# EAGLE design Antennaboard_AndesiteV3Rel (EAGLE 6.5.0)

## Sheet 1 of 2
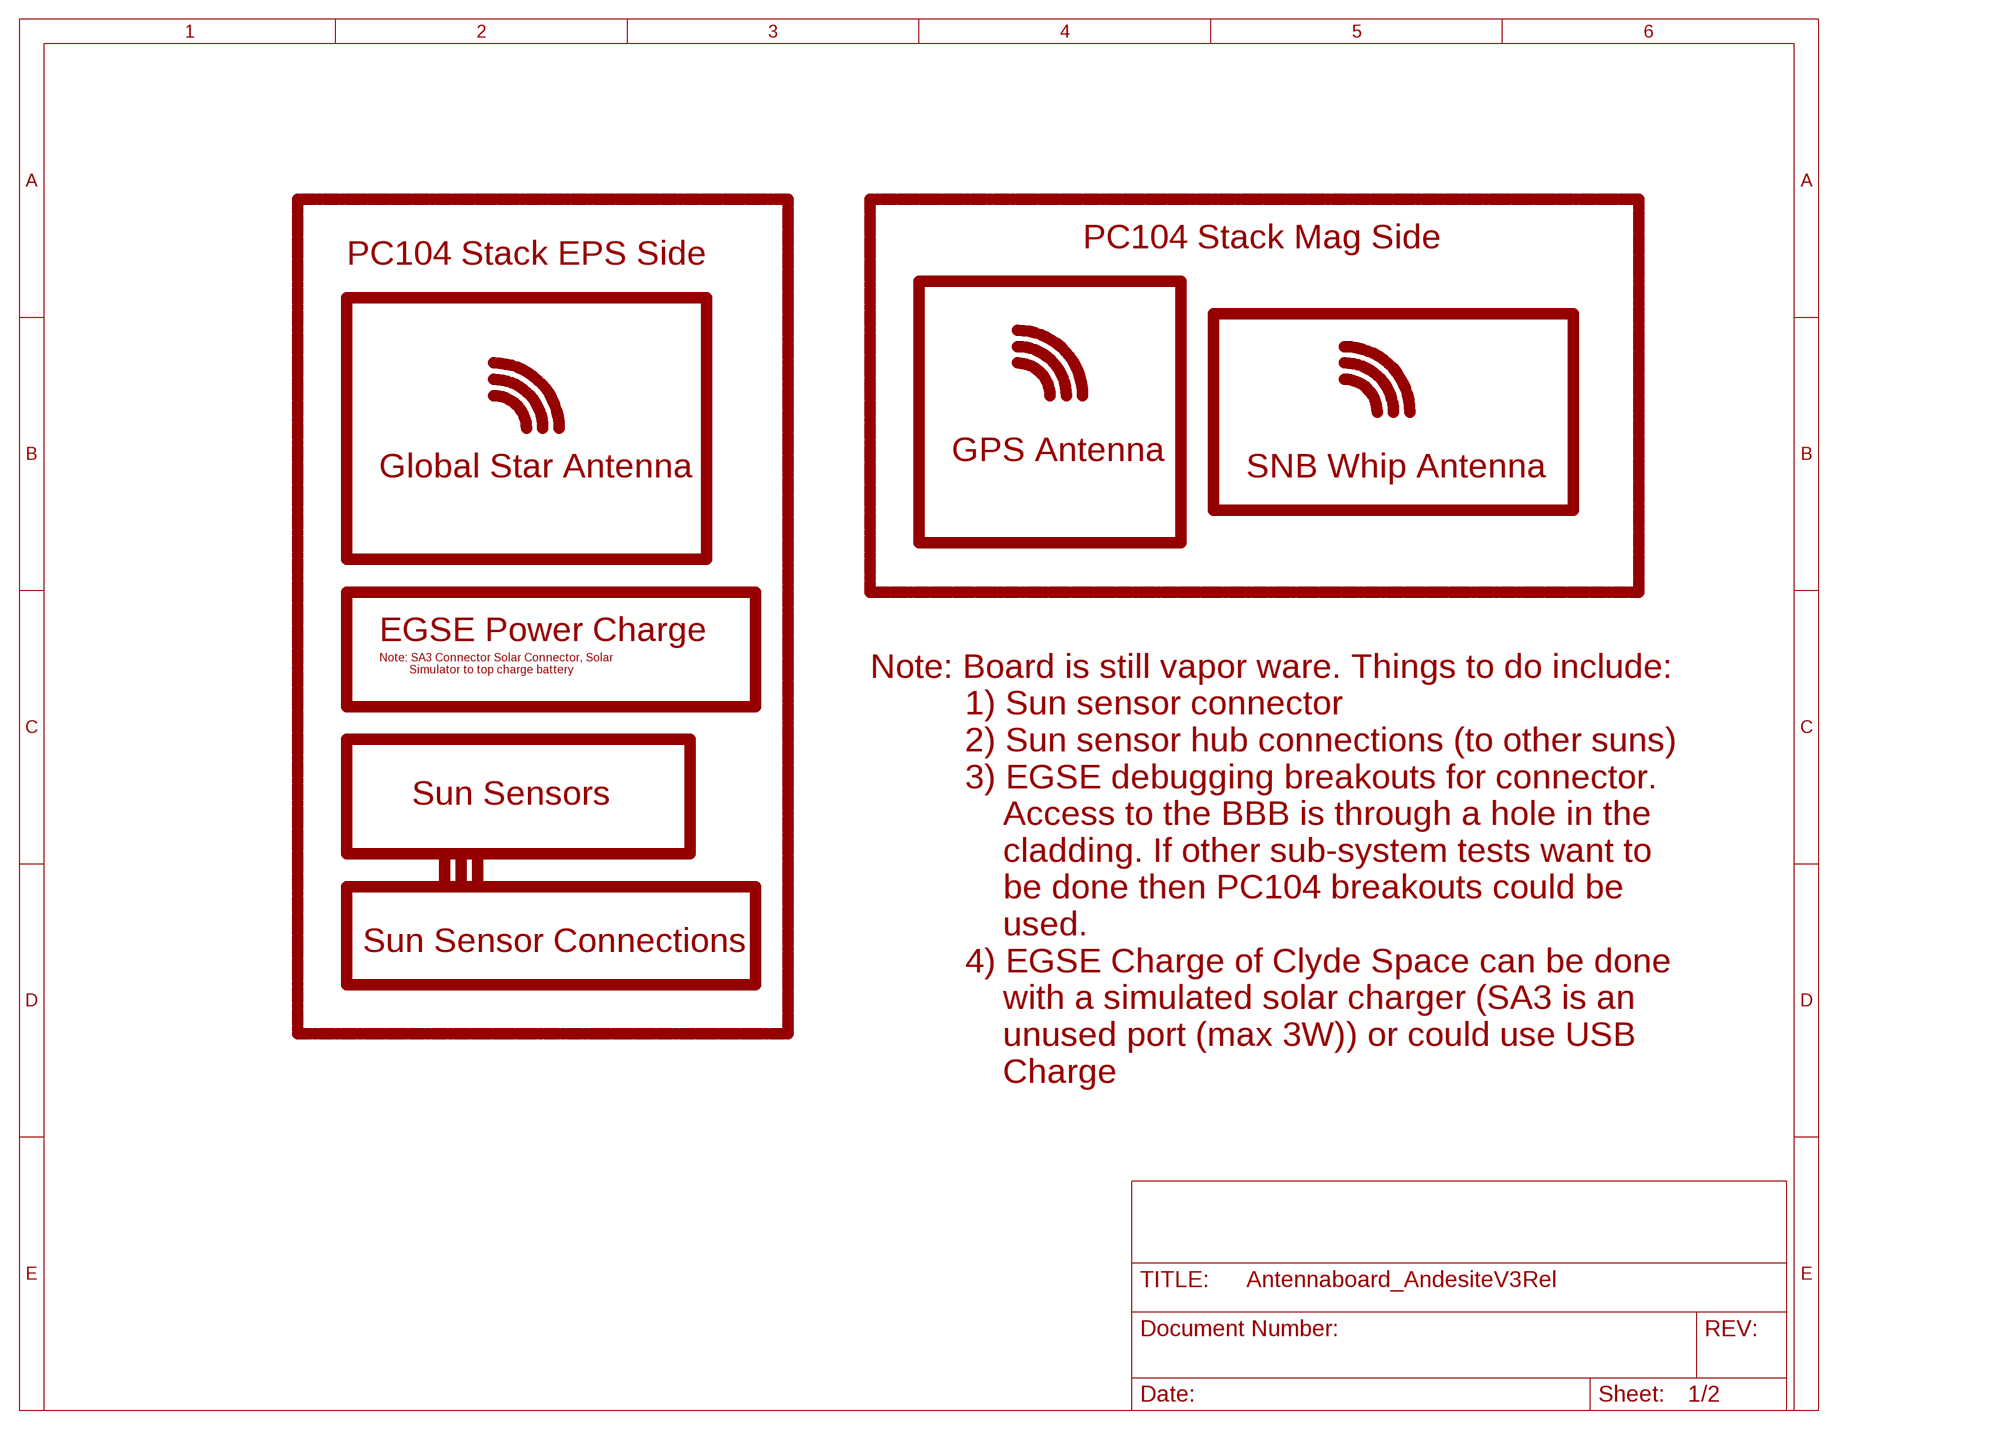
[diagram p0: schematic, sheet 1]

### Notes on the sheet
- PC104 Stack Mag Side
- PC104 Stack EPS Side
- GPS Antenna
- Global Star Antenna | SNB Whip Antenna
- EGSE Power Charge
- Note: SA3 Connector Solar Connector, Solar 
            Simulator to top charge battery
- Sun Sensors
- Sun Sensor Connections
- Note: Board is still vapor ware. Things to do include:
            1) Sun sensor connector
            2) Sun sensor hub connections (to other suns)
            3) EGSE debugging breakouts for connector. 
                Access to the BBB is through a hole in the 
                cladding. If other sub-system tests want to 
                be done then PC104 breakouts could be 
                used.
            4) EGSE Charge of Clyde Space can be done 
                with a simulated solar charger (SA3 is an 
                unused port (max 3W)) or could use USB 
                Charge

## Sheet 2 of 2
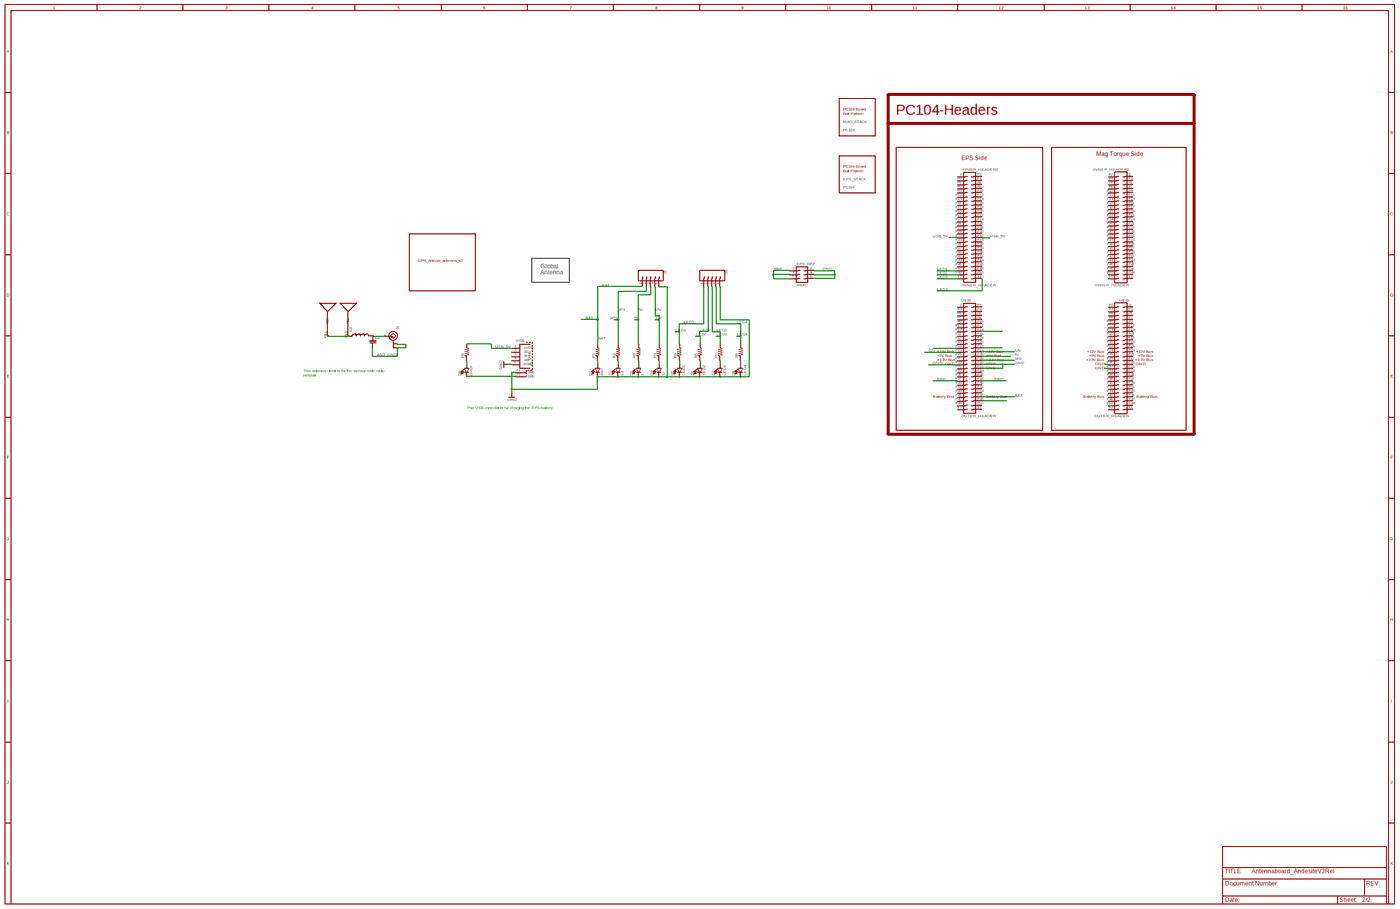
[diagram p1: schematic, sheet 2, overview]
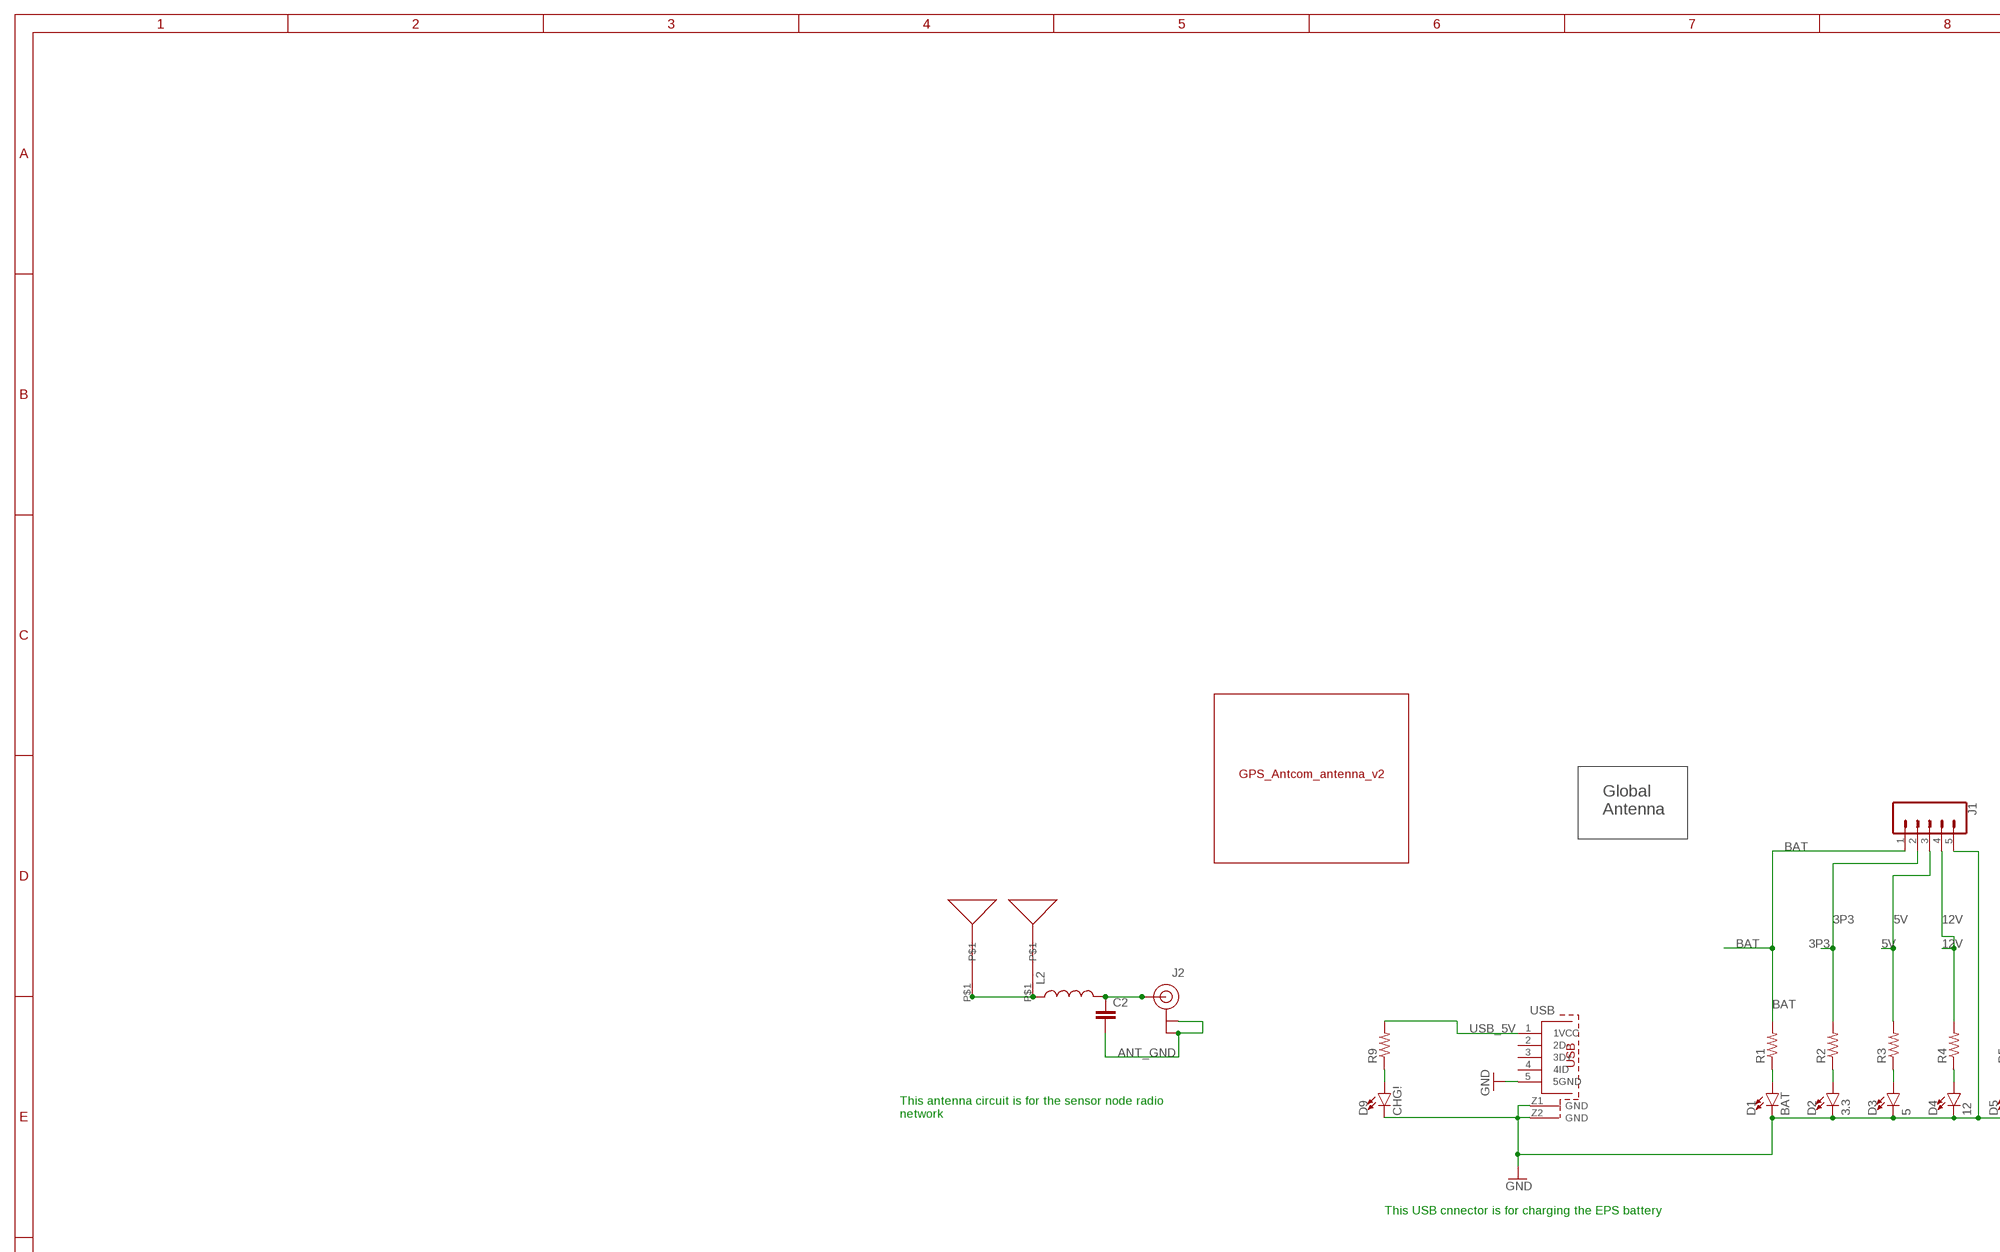
[diagram p2: schematic, sheet 2, part 1 of 4]
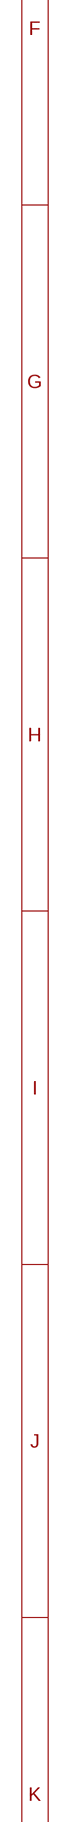
[diagram p3: schematic, sheet 2, part 2 of 4]
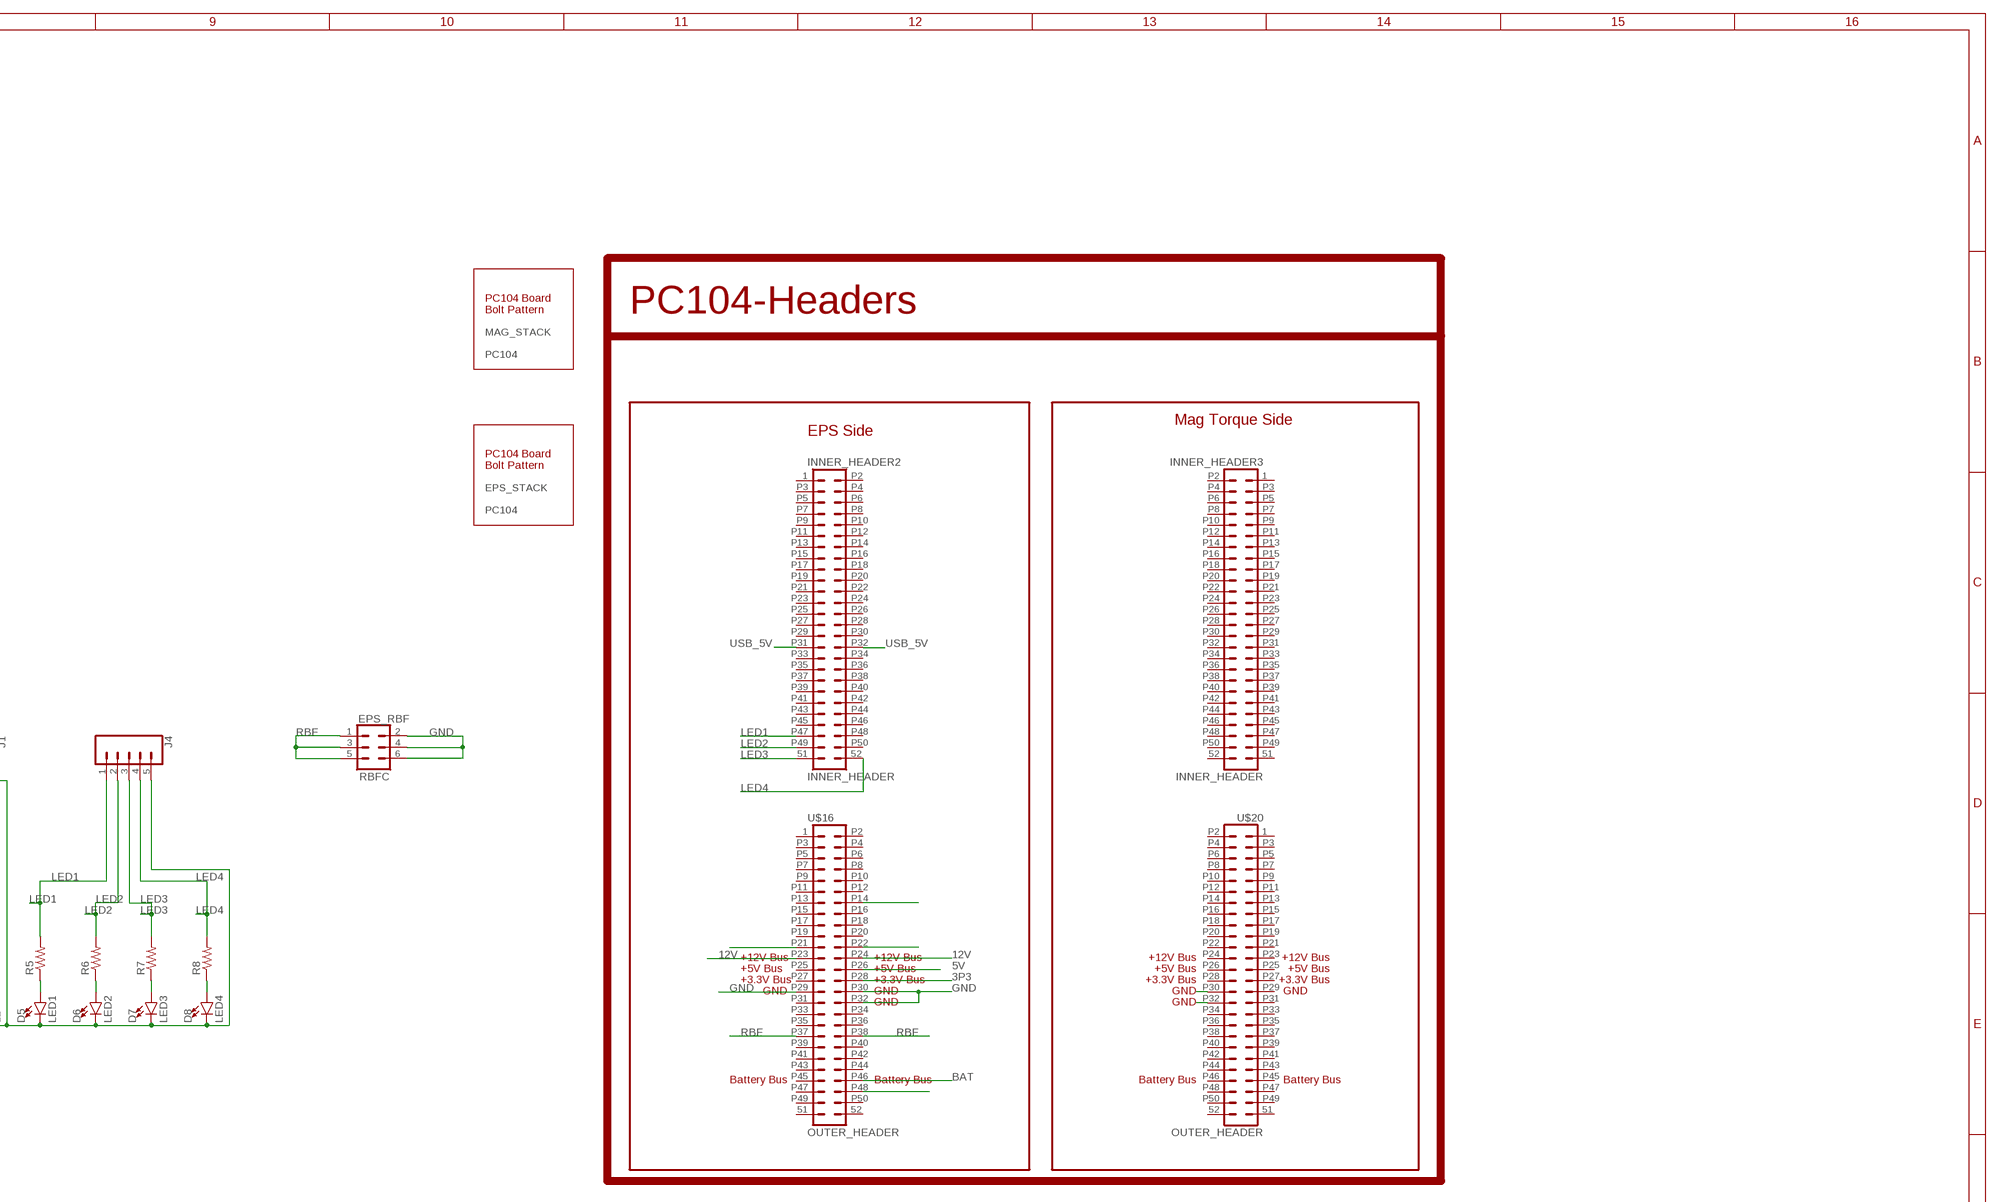
[diagram p4: schematic, sheet 2, part 3 of 4]
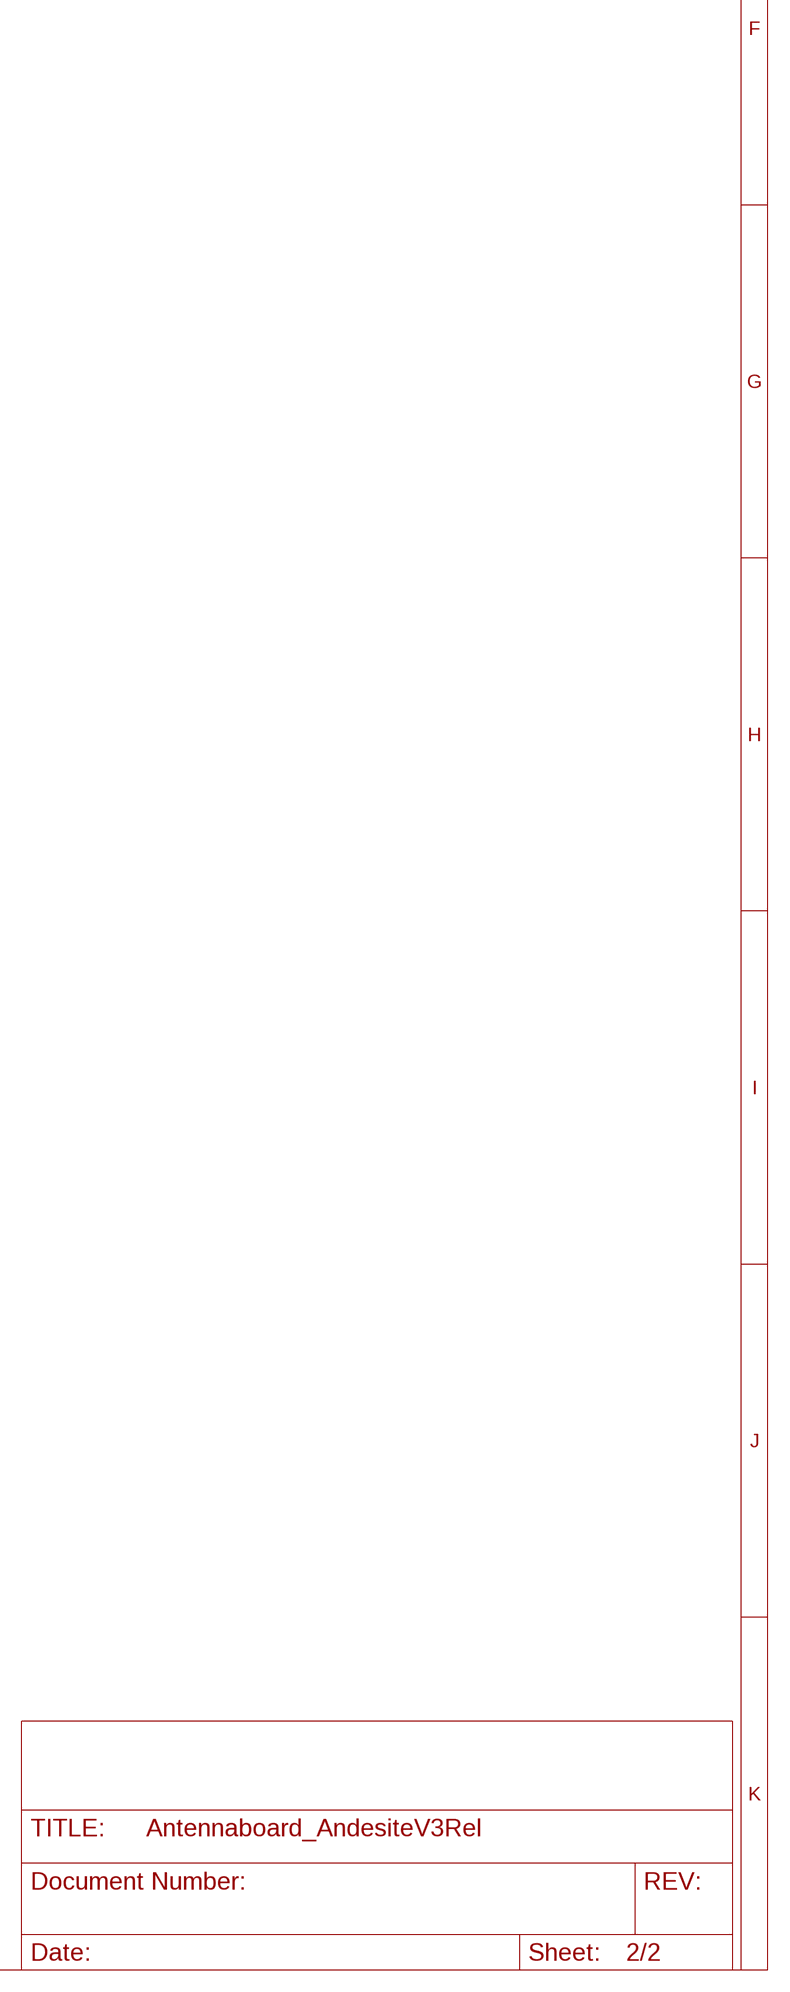
[diagram p5: schematic, sheet 2, part 4 of 4]

### Parts
C2  CAP1210  [1210]
D1  BAT  LED-RED0603  [LED-0603]
D2  3.3  LED-RED0603  [LED-0603]
D3  5  LED-RED0603  [LED-0603]
D4  12  LED-RED0603  [LED-0603]
D5  LED1  LED-RED0603  [LED-0603]
D6  LED2  LED-RED0603  [LED-0603]
D7  LED3  LED-RED0603  [LED-0603]
D8  LED4  LED-RED0603  [LED-0603]
D9  CHG!  LED-RED0603  [LED-0603]
EPS_RBF  RBFC  CONN_03X2FEMALE  [2X3]
EPS_STACK  PC104  [PC104]
INNER_HEADER2  INNER_HEADER  [2X26]
INNER_HEADER3  INNER_HEADER  [2X26]
J1  CONN_05NO_SILK  [1X05_NO_SILK]
J2  U.FL  [U.FL]
J4  CONN_05NO_SILK  [1X05_NO_SILK]
L2  INDUCTOR1210  [1210]
MAG_STACK  PC104  [PC104]
R1  R-US_R0603  [R0603]
R2  R-US_R0603  [R0603]
R3  R-US_R0603  [R0603]
R4  R-US_R0603  [R0603]
R5  R-US_R0603  [R0603]
R6  R-US_R0603  [R0603]
R7  R-US_R0603  [R0603]
R8  R-US_R0603  [R0603]
R9  R-US_R0603  [R0603]
U$1  ANTENNA  [GLOBAL_ANTENNA]
U$2  GPS_ANTCOM_ANTENNA  [GPS_ANTCOM_2]
U$3  SNB_ANT  [SLOT]
U$16  OUTER_HEADER  [2X26]
U$18  SNB_ANT  [SLOT]
U$20  OUTER_HEADER  [2X26]
USB  614105150721  [614105150721]

### Nets
3P3: J1.2 R2.2 U$16.P28
5V: J1.3 R3.2 U$16.P26
12V: J1.4 R4.2 U$16.P23 U$16.P24
ANT_GND: C2.2 J2.P$1(GND) J2.P$2(GND)
BAT: J1.1 R1.2 U$16.P46
GND: D1.C D2.C D3.C D4.C D5.C D6.C D7.C D8.C D9.C EPS_RBF.2 EPS_RBF.4 EPS_RBF.6 J1.5 J4.5 U$16.P21 U$16.P22 U$16.P29 U$16.P30 U$16.P32 U$16.P48 USB.5(5GND) USB.Z1(GND) USB.Z2(GND)
LED1: INNER_HEADER2.P47 J4.1 R5.2
LED2: INNER_HEADER2.P49 J4.2 R6.2
LED3: INNER_HEADER2.51 J4.3 R7.2
LED4: INNER_HEADER2.52 J4.4 R8.2
N$2: D9.A R9.1
N$3: U$20.P32
N$4: U$20.P30
N$7: D1.A R1.1
N$8: U$16.P14
N$20: D2.A R2.1
N$21: D3.A R3.1
N$22: D4.A R4.1
N$23: D5.A R5.1
N$24: D6.A R6.1
N$25: D7.A R7.1
N$26: D8.A R8.1
N$37: C2.1 J2.P$3(SIGNAL) L2.2
N$38: L2.1 U$3.P$1 U$18.P$1
RBF: EPS_RBF.1 EPS_RBF.3 EPS_RBF.5 U$16.P37 U$16.P38
USB_5V: INNER_HEADER2.P31 INNER_HEADER2.P32 R9.2 USB.1(1VCC)
Unconnected: INNER_HEADER2.1 INNER_HEADER2.P2 INNER_HEADER2.P3 INNER_HEADER2.P4 INNER_HEADER2.P5 INNER_HEADER2.P6 INNER_HEADER2.P7 INNER_HEADER2.P8 INNER_HEADER2.P9 INNER_HEADER2.P10 INNER_HEADER2.P11 INNER_HEADER2.P12 INNER_HEADER2.P13 INNER_HEADER2.P14 INNER_HEADER2.P15 INNER_HEADER2.P16 INNER_HEADER2.P17 INNER_HEADER2.P18 INNER_HEADER2.P19 INNER_HEADER2.P20 INNER_HEADER2.P21 INNER_HEADER2.P22 INNER_HEADER2.P23 INNER_HEADER2.P24 INNER_HEADER2.P25 INNER_HEADER2.P26 INNER_HEADER2.P27 INNER_HEADER2.P28 INNER_HEADER2.P29 INNER_HEADER2.P30 INNER_HEADER2.P33 INNER_HEADER2.P34 INNER_HEADER2.P35 INNER_HEADER2.P36 INNER_HEADER2.P37 INNER_HEADER2.P38 INNER_HEADER2.P39 INNER_HEADER2.P40 INNER_HEADER2.P41 INNER_HEADER2.P42 INNER_HEADER2.P43 INNER_HEADER2.P44 INNER_HEADER2.P45 INNER_HEADER2.P46 INNER_HEADER2.P48 INNER_HEADER2.P50 INNER_HEADER3.1 INNER_HEADER3.51 INNER_HEADER3.52 INNER_HEADER3.P2 INNER_HEADER3.P3 INNER_HEADER3.P4 INNER_HEADER3.P5 INNER_HEADER3.P6 INNER_HEADER3.P7 INNER_HEADER3.P8 INNER_HEADER3.P9 INNER_HEADER3.P10 INNER_HEADER3.P11 INNER_HEADER3.P12 INNER_HEADER3.P13 INNER_HEADER3.P14 INNER_HEADER3.P15 INNER_HEADER3.P16 INNER_HEADER3.P17 INNER_HEADER3.P18 INNER_HEADER3.P19 INNER_HEADER3.P20 INNER_HEADER3.P21 INNER_HEADER3.P22 INNER_HEADER3.P23 INNER_HEADER3.P24 INNER_HEADER3.P25 INNER_HEADER3.P26 INNER_HEADER3.P27 INNER_HEADER3.P28 INNER_HEADER3.P29 INNER_HEADER3.P30 INNER_HEADER3.P31 INNER_HEADER3.P32 INNER_HEADER3.P33 INNER_HEADER3.P34 INNER_HEADER3.P35 INNER_HEADER3.P36 INNER_HEADER3.P37 INNER_HEADER3.P38 INNER_HEADER3.P39 INNER_HEADER3.P40 INNER_HEADER3.P41 INNER_HEADER3.P42 INNER_HEADER3.P43 INNER_HEADER3.P44 INNER_HEADER3.P45 INNER_HEADER3.P46 INNER_HEADER3.P47 INNER_HEADER3.P48 INNER_HEADER3.P49 INNER_HEADER3.P50 U$16.1 U$16.51 U$16.52 U$16.P2 U$16.P3 U$16.P4 U$16.P5 U$16.P6 U$16.P7 U$16.P8 U$16.P9 U$16.P10 U$16.P11 U$16.P12 U$16.P13 U$16.P15 U$16.P16 U$16.P17 U$16.P18 U$16.P19 U$16.P20 U$16.P25 U$16.P27 U$16.P31 U$16.P33 U$16.P34 U$16.P35 U$16.P36 U$16.P39 U$16.P40 U$16.P41 U$16.P42 U$16.P43 U$16.P44 U$16.P45 U$16.P47 U$16.P49 U$16.P50 U$20.1 U$20.51 U$20.52 U$20.P2 U$20.P3 U$20.P4 U$20.P5 U$20.P6 U$20.P7 U$20.P8 U$20.P9 U$20.P10 U$20.P11 U$20.P12 U$20.P13 U$20.P14 U$20.P15 U$20.P16 U$20.P17 U$20.P18 U$20.P19 U$20.P20 U$20.P21 U$20.P22 U$20.P23 U$20.P24 U$20.P25 U$20.P26 U$20.P27 U$20.P28 U$20.P29 U$20.P31 U$20.P33 U$20.P34 U$20.P35 U$20.P36 U$20.P37 U$20.P38 U$20.P39 U$20.P40 U$20.P41 U$20.P42 U$20.P43 U$20.P44 U$20.P45 U$20.P46 U$20.P47 U$20.P48 U$20.P49 U$20.P50 USB.2(2D-) USB.3(3D+) USB.4(4ID)

### Notes on the sheet
- PC104-Headers
- Mag Torque Side
- EPS Side
- This antenna circuit is for the sensor node radio
  network
- This USB cnnector is for charging the EPS battery

## Library data of the parts
C2 = SparkFun-Passives:CAP: Capacitor Standard 0603 ceramic capacitor, and 0.1" leaded capacitor.
D1-D9 = SparkFun-LED:LED-RED: Red SMD LED Used in manufacturing of most products at SparkFun Packages: 0603 - SMD 0603 package [Product Link] <http://docs.avagotech.com/docs/AV02-0551EN> 0603 SMART - SMD 0603 SMART package ( more efficient and expensive)[Product Link] <http://www.osram-os.com/Graphics/XPic2/00077099_0.pdf> 1206 - SMD1206 package [Product Link] <https://www.sparkfun.com/datasheets/DevTools/LilyPad/Q150OVS4.pdff> SparkFun Products: Pro Mini 328 -5V <https://www.sparkfun.com/products/821> RedBoard <https://www.sparkfun.com/products/12757> IOIO-OTG <https://www.sparkfun.com/products/13613>; PROD_ID: DIO-00819; VALUE: RED
EPS_RBF = SparkFun-Connectors:CONN_03X2: Multi connection point. Often used as Generic Header-pin footprint for 0.1 inch spaced/style header connections You can populate with any combo of single row headers, but if you'd like an exact match, check these: Header - 2x3 (Male, 0.1") <https://www.sparkfun.com/products/12807> (PRT-12807) Header - 2x3 (Female, 0.1") <https://www.sparkfun.com/products/13010> (PRT-13010) 2x3 Pin Shrouded Header <https://www.sparkfun.com/products/10877> (PRT-10877) On any of the 0.1 inch spaced packages, you can populate with these: Break Away Headers - Straight <https://www.sparkfun.com/products/116> (PRT-00116) Break Away Male Headers - Right Angle <https://www.sparkfun.com/products/553> (PRT-00553) Female Headers <https://www.sparkfun.com/products/115> (PRT-00115) Break Away Headers - Machine Pin <https://www.sparkfun.com/products/117> (PRT-00117) Break Away Female Headers - Swiss Machine Pin <https://www.sparkfun.com/products/743> (PRT-00743) Special note: the shrouded connector mates well with our 3x2 ribbon cables: Ribbon Crimp Connector - 6-pin (2x3, Female) <https://www.sparkfun.com/products/10651> (PRT-10651) Ribbon Cable - 6 wire (15ft) <https://www.sparkfun.com/products/10646> (PRT-10646); PROD_ID: CONN-11566; VALUE: FEMALE 2x3
EPS_STACK MAG_STACK = PC104_Cubesat:PC104
INNER_HEADER2 INNER_HEADER3 = PC104_Cubesat:INNER_HEADER
J1 J4 = SparkFun-Connectors:CONN_05: Multi connection point. Often used as Generic Header-pin footprint for 0.1 inch spaced/style header connections On any of the 0.1 inch spaced packages, you can populate with these: Break Away Headers - Straight <https://www.sparkfun.com/products/116> (PRT-00116) Break Away Male Headers - Right Angle <https://www.sparkfun.com/products/553> (PRT-00553) Female Headers <https://www.sparkfun.com/products/115> (PRT-00115) Break Away Headers - Machine Pin <https://www.sparkfun.com/products/117> (PRT-00117) Break Away Female Headers - Swiss Machine Pin <https://www.sparkfun.com/products/743> (PRT-00743) For SCREWTERMINALS and SPRING TERMINALS visit here: Screw Terimnals on SparkFun.com <https://www.sparkfun.com/search/results?term=Screw+Terminals> (5mm/3.5mm/2.54mm spacing) This device is also useful as a general connection point to wire up your design to another part of your project. Our various solder wires solder well into these plated through hole pads. Hook-Up Wire - Assortment (Stranded, 22 AWG) <https://www.sparkfun.com/products/11375> (PRT-11375) Hook-Up Wire - Assortment (Solid Core, 22 AWG) <https://www.sparkfun.com/products/11367> (PRT-11367) View the entire wire category on our website here <https://www.sparkfun.com/categories/141> Special notes: Molex polarized connector foot print use with SKU : PRT-08231 with associated crimp pins and housings. 1MM SMD Version SKU: PRT-10208
J2 = SparkFun-Connectors:U.FL: SMD antenna connector- WRL-09144; PROD_ID: CONN-09193
L2 = SparkFun-Passives:INDUCTOR: Inductors Basic Inductor/Choke - 0603 and 1206. Footprints are not proven and vary greatly between part numbers. INDUCTOR POWER 3.3UH 4.0A SMD 0.197" L x 0.197" W x 0.177" H (5.00mm x 5.00mm x 4.50mm)
R1-R9 = resistor:R-US_: RESISTOR, American symbol
U$1 = PC104_Cubesat:ANTENNA
U$2 = GPS_antcom_05022017v1:GPS_ANTCOM_ANTENNA
U$3 U$18 = PC104_Cubesat:SNB_ANT
U$16 U$20 = PC104_Cubesat:OUTER_HEADER
USB = Wurth_Elektronik_Electromechanic_Input-Output_Connectors_rev16b:614105150721: WR-COM_USB_Micro Type B_Vertical_THT; Micro Type B Vertical THT- Tape & Reel not for Pick & Place machine Code : Con_I-O_COM_USB_2.0_B_614105150721_614105150721 <http://katalog.we-online.de/media/images/eican/Con_I-O_COM_USB_2.0_B_614105150721_pf2.jpg> Details see: http://katalog.we-online.de/em/datasheet/614105150721.pdf Created 12/08/2014, Dan Xu 2014 (C) Wurth Elektronik

## Board
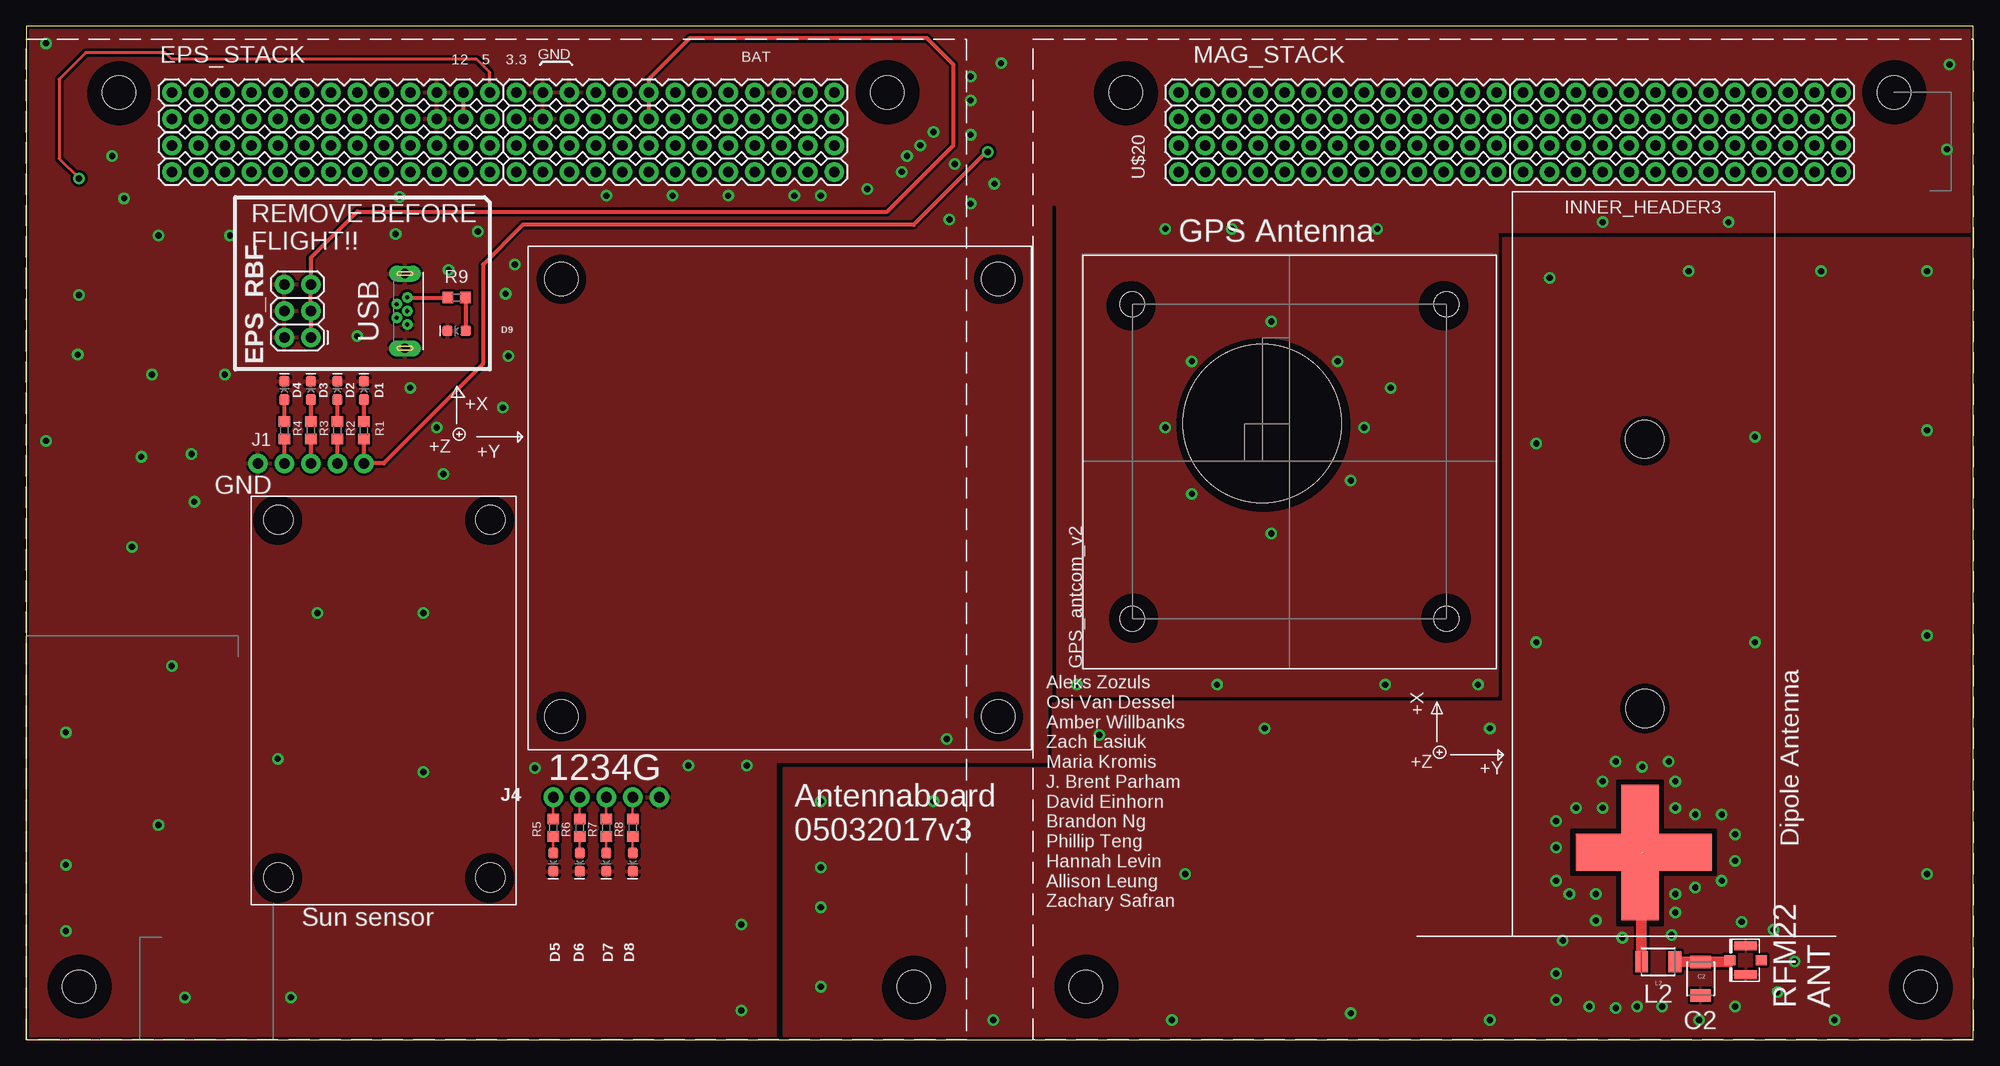
[diagram p6: board, top side]
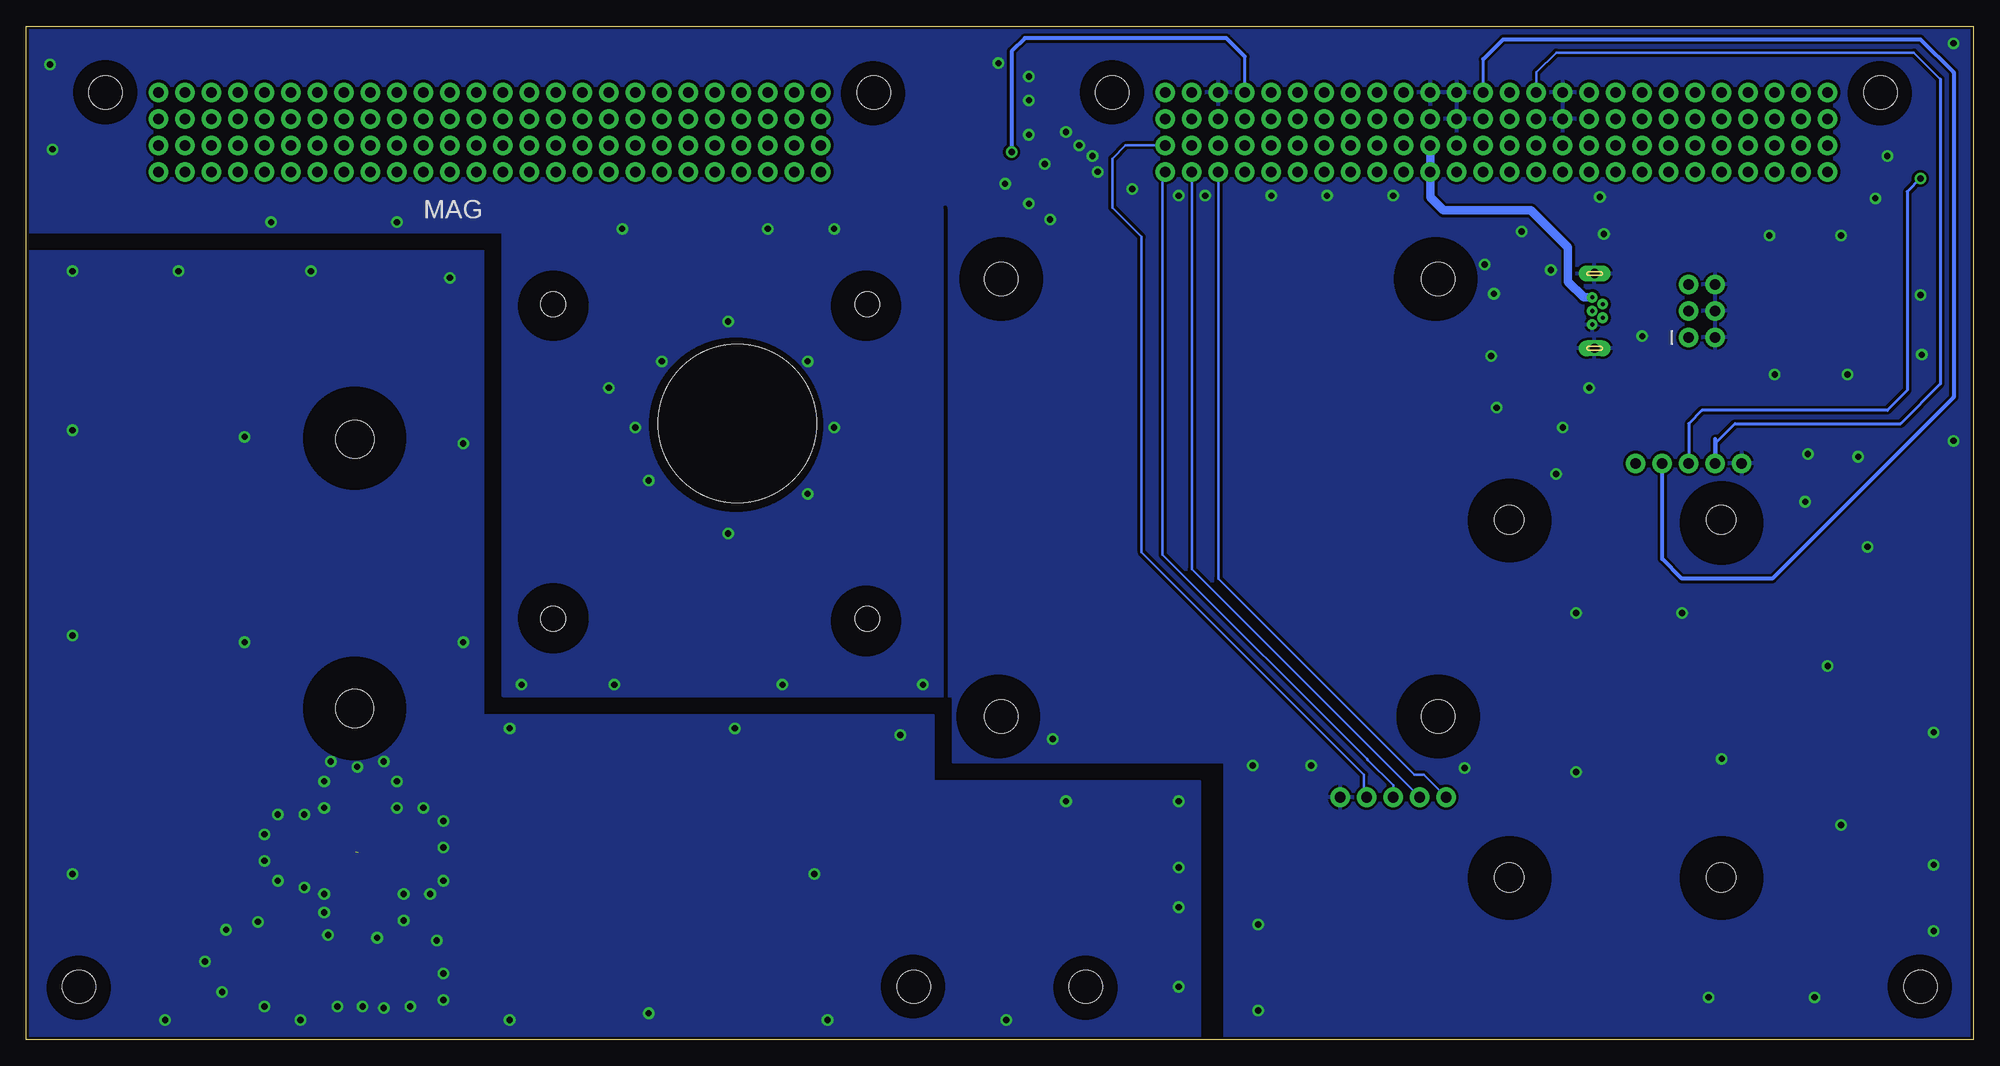
[diagram p7: board, bottom side, seen from below]

Size 186.69 x 97.16 mm. Coordinates in mm from the lower left corner, seen from the top.
Outline: 0,0 186.69,0 186.69,97.16 0,97.16 0,0
Copper layers (1*16): Top 0.035mm / dielectric 1.5mm / Bottom 0.035mm
Design rules "SparkFun *": minimum track width 8mil, minimum drill 15mil, track to track 10mil, track to pad 8mil, pad to pad 6mil, via to via 8mil, smd to smd 6mil, copper to edge 10mil, drill to drill 8mil, minimum pad ring 12mil, minimum via ring 10mil, stop-mask expansion 6mil, vias tented up to drill 15mil, thermal gap 10mil
Holes 2.8 mm at 44.5,15.54 24.18,15.54 24.18,49.83 44.5,49.83
Holes 3.66 mm at 155.17,57.56 155.19,31.75
tRestrict: area 49.2,70.7 to 53.5,75.1; area 91.1,70.7 to 95.4,75.1; area 91.1,28.8 to 95.4,33.1; area 49.2,28.8 to 53.5,33.1; area 42.3,47.6 to 46.6,51.9; area 22,47.6 to 26.3,51.9; area 22,13.3 to 26.3,17.6; area 42.3,13.3 to 46.6,17.6; area 104,38.2 to 108.3,42.5; area 103.8,68.2 to 108.1,72.5; area 133.7,68.2 to 138,72.5; area 134,38.2 to 138.3,42.5; 4 more areas; 1 lines
bRestrict: area 150.8,53.2 to 159.6,62.1; area 150.8,53.2 to 159.6,62.1; area 150.8,27.3 to 159.6,36.2; area 103.1,67.3 to 109.2,73.4; area 133.1,67.3 to 139.2,73.4; area 133.1,37.3 to 139.2,43.4; area 103.1,37.1 to 109.2,43.2; area 89.5,69.2 to 96.9,76.6; area 89.8,27.3 to 97.2,34.7; area 47.6,27.3 to 55,34.7; area 47.9,69.2 to 55.3,76.6; area 40.8,46.1 to 48.1,53.5; 4 more areas; 1 lines

### Footprints (pad centres in the part's own frame; a part is rotated, then mirrored left to right if it is on the bottom)
1210 = smd 1.2 x 2: 1 -1.6,0; 2 1.6,0
LED-0603 = smd 1 x 1: A -0.877,0; C 0.877,0
2X3 = drill 1.016 pad 1.88: 1 0,0; 2 0,2.54; 3 2.54,0; 4 2.54,2.54; 5 5.08,0; 6 5.08,2.54
PC104 = hole 3.2: 8.89,90.805; 82.55,90.805; 85.09,5.08; 5.08,5.08
2X26 = drill 1.016 pad 1.88: 1 1.27,-1.27; 51 1.27,-64.77; 52 3.81,-64.77; P2 3.81,-1.27; P3 1.27,-3.81; P4 3.81,-3.81; P5 1.27,-6.35; P6 3.81,-6.35; P7 1.27,-8.89; P8 3.81,-8.89; P9 1.27,-11.43; P10 3.81,-11.43; P11 1.27,-13.97; P12 3.81,-13.97; P13 1.27,-16.51; P14 3.81,-16.51; P15 1.27,-19.05; P16 3.81,-19.05; P17 1.27,-21.59; P18 3.81,-21.59; P19 1.27,-24.13; P20 3.81,-24.13; P21 1.27,-26.67; P22 3.81,-26.67; P23 1.27,-29.21; P24 3.81,-29.21; P25 1.27,-31.75; P26 3.81,-31.75; P27 1.27,-34.29; P28 3.81,-34.29; P29 1.27,-36.83; P30 3.81,-36.83; P31 1.27,-39.37; P32 3.81,-39.37; P33 1.27,-41.91; P34 3.81,-41.91; P35 1.27,-44.45; P36 3.81,-44.45; P37 1.27,-46.99; P38 3.81,-46.99; P39 1.27,-49.53; P40 3.81,-49.53; P41 1.27,-52.07; P42 3.81,-52.07; P43 1.27,-54.61; P44 3.81,-54.61; P45 1.27,-57.15; P46 3.81,-57.15; P47 1.27,-59.69; P48 3.81,-59.69; P49 1.27,-62.23; P50 3.81,-62.23
1X05_NO_SILK = drill 1.016 pad 1.88: 1 0,0; 2 2.54,0; 3 5.08,0; 4 7.62,0; 5 10.16,0
U.FL = smd 2.2 x 0.85: P$1 0,1.375; P$2 0,-1.375 | smd 1.05 x 1: P$3 1.525,0; P$4 -1.525,0
R0603 = smd 1 x 1.1: 1 -0.85,0; 2 0.85,0
GLOBAL_ANTENNA = hole 3.2: 0,0; 41.91,0; 41.91,41.91; 0,41.91
GPS_ANTCOM_2 = hole 2.388: 4.801,34.925; 4.801,4.801; 34.925,4.801; 34.925,34.925 | hole 15.189: 23.495,22.454
SLOT = smd 13 x 3.556: P$1 6.5,2.746
614105150721 = drill 0.4 pad 0.94: 1 -1.3,0.22; 2 -0.65,-0.78; 3 0,0.22; 4 0.65,-0.78; 5 1.3,0.22 | drill 0.9 pad 1.27 long: Z1 -3.575,0; Z2 3.575,0

### Placement (x,y rotation side)
C2  160.53,5.84 270 top
D1  32.38,62.23 90 top
D2  29.84,62.23 90 top
D3  27.3,62.23 90 top
D4  24.77,62.23 90 top
D5  50.55,17.02 270 top
D6  53.09,17.02 270 top
D7  55.63,17.02 270 top
D8  58.17,17.02 270 top
D9  41.27,67.94 180 top
EPS_RBF  27.3,67.31 90 top
EPS_STACK  0,0 0 top
INNER_HEADER2  12.7,81.92 90 top
INNER_HEADER3  109.22,81.92 90 top
J1  32.38,55.24 180 top
J2  164.85,7.62 180 top
J4  50.55,23.24 0 top
L2  156.46,7.49 0 top
MAG_STACK  96.52,0 0 top
R1  32.38,58.42 270 top
R2  29.84,58.42 270 top
R3  27.3,58.42 270 top
R4  24.77,58.42 270 top
R5  50.55,20.32 90 top
R6  53.09,20.32 90 top
R7  55.63,20.32 90 top
R8  58.17,20.32 90 top
R9  41.27,71.12 180 top
U$1  51.31,30.99 0 top
U$2  140.97,35.56 90 top
U$3  157.48,11.43 90 top
U$16  12.7,87 90 top
U$18  148.59,15.24 0 top
U$20  109.22,87 90 top
USB  36.32,69.85 270 top

### Tracks (layer width: path | path; a pad name or v marks a point on that pad's centre or on a via)
3P3
  Top 0.406: R2.2 J1.2
  Bottom 0.305: U$16.P28 46.99,93.98
  Bottom 0.406: 46.99,93.98 45.09,95.89 5.08,95.89 1.91,92.71 1.91,61.59 19.3,44.2 27.94,44.2 29.84,46.1 J1.2 29.84,54.61
5V  (via drill 0.6)
  Top 0.305: U$16.P26 44.45,92.71 43.18,93.98 13.97,93.98 13.34,94.61 5.71,94.61 3.17,92.08 3.17,84.45 v5.08,82.55
  Top 0.406: R3.2 J1.3
  Bottom 0.305: v5.08,82.55 6.35,81.28 6.35,62.23 8.26,60.33 26.04,60.33 27.3,59.05 J1.3
12V
  Top 0.406: R4.2 J1.4 | U$16.P24 U$16.P23
  Bottom 0.254: U$16.P24 41.91,92.71 40.01,94.61 5.71,94.61 3.17,92.08
  Bottom 0.305: 24.77,54.61 J1.4 | 24.77,57.15 22.86,59.05 6.99,59.05 3.17,62.87 3.17,92.08
  Bottom 0.406: 24.77,57.15 J1.4 R4.2
ANT_GND  (via drill 0.6)
  other vias: 154.94,26.16 157.48,26.67 158.12,24.77 158.12,22.23 160.02,21.59 162.56,21.59 163.83,19.68 163.83,17.14 162.56,15.24 160.02,14.61 158.12,13.97 158.12,12.19 152.4,26.67 151.13,24.77 151.13,22.23 148.59,22.23 146.69,20.95 146.69,18.41 146.69,15.24 147.96,13.97 150.5,13.97 150.5,11.43 153.03,9.78 146.69,6.35 157.73,10.03 169.54,7.49 167.89,4.57 163.83,3.17 160.4,1.91 156.84,3.17 154.43,3.17 152.4,3.05 149.86,3.17 147.32,9.53 76.2,22.86 165.74,57.78 76.2,16.51 76.2,12.7 165.74,38.1 76.2,5.08 92.71,1.91 109.86,1.91 127,2.54 146.69,3.81 140.34,1.91 173.35,1.91 182.25,15.88 182.25,38.73 102.87,29.21 87,22.86 118.75,29.84 140.34,29.84 144.78,38.1 111.12,15.88 144.78,57.15 182.25,58.42 182.25,73.66 172.09,73.66 159.38,73.66 146.05,73.03 164.47,11.3 167.51,10.54
  pour Top: 191.9,76.83 141.6,76.83 141.6,32.38 98.42,32.38 98.42,26.04 72.64,26.04 72.64,-6.35 191.64,-6.35
  pour Bottom: 191.13,75.56 142.88,75.56 142.88,31.11 99.69,31.11 99.69,24.77 74.17,24.77 74.17,-6.99 191.13,-6.99
BAT  (via drill 0.6)
  Top 0.406: R1.2 J1.1 34.29,55.24 43.81,64.77 43.81,74.3 47.62,78.11 85.09,78.11 92.08,85.09 v92.2,85.09
  Bottom 0.305: U$16.P46 69.85,94.23
  Bottom 0.406: 69.85,94.23 71.63,96.01 90.93,96.01 92.2,94.74 v92.2,85.09
GND  (via drill 0.6)
  other vias: 4.95,65.66 46.23,65.53 40.51,73.79 46.86,74.3 45.97,71.5 43.31,77.47 55.63,80.9 35.81,80.77 35.43,77.22 31.75,67.44 48.77,26.04 25.4,4.06 15.24,4.06 3.81,10.41 3.81,16.76 12.7,20.57 3.81,29.46 13.97,35.81 1.91,57.4 12.06,63.75 5.08,71.37 1.91,95.5 8.26,84.71 19.05,63.75 10.16,47.24 15.88,56.13 27.94,40.89 38.1,25.65 24.13,26.92 38.1,40.89 39.37,58.67 12.7,77.09 67.31,80.9 36.83,62.48 84.45,84.71 92.84,82.04 109.22,77.72 129.54,77.72 184.15,85.34 130.3,34.04 115.57,77.72 100.71,34.04 163.19,78.36 151.13,78.36 139.19,34.04 130.81,62.48 69.09,26.29 111.76,65.02 125.73,65.02 127,53.59 111.76,52.32 109.22,58.67 128.27,58.67 119.38,48.51 88.27,28.83 45.72,60.58 40.01,54.23 119.38,68.83 93.47,93.6 184.4,93.47 114.17,34.04 63.5,26.29 68.58,11.05 68.58,2.79 80.64,81.53 76.2,80.9 73.66,80.9 16.13,51.56 11.05,55.88 85.72,85.72 83.95,83.19 19.56,77.09 9.4,80.64 61.98,80.9 90.55,92.33 90.55,90.04 90.55,86.74 87,87 89.03,83.95 90.55,80.14 88.52,78.61
  pour Top: -1.91,99.69 191.77,99.69 191.77,77.47 140.97,77.47 140.97,33.02 97.79,33.02 97.79,31.75 97.79,26.67 72.39,26.67 71.75,26.67 71.75,-3.17 -3.17,-3.17 -3.17,-1.91 -3.17,99.69
  pour Top: -1.91,99.69 191.77,99.69 191.77,77.47 140.97,77.47 140.97,33.02 97.79,33.02 97.79,31.75 97.79,26.67 72.39,26.67 71.75,26.67 71.75,-3.17 -3.17,-3.17 -3.17,-1.91 -3.17,99.69
  pour Bottom: -7.62,106.05 191.77,106.68 191.77,77.47 140.97,77.47 140.97,33.02 97.79,33.02 97.79,26.67 71.75,26.67 71.75,-3.17 -6.99,-3.17
LED1
  Top 0.254: J4.1 R5.2
  Bottom 0.254: INNER_HEADER2.P47 72.39,44.2 53.59,25.4 52.7,25.4 J4.1
LED2
  Top 0.254: J4.2 R6.2
  Bottom 0.254: INNER_HEADER2.P49 74.93,45.09 J4.2
LED3
  Top 0.254: J4.3 R7.2
  Bottom 0.254: J4.3 55.63,24.38 58.04,26.8 58.17,26.92 77.72,46.48 77.72,82.93 INNER_HEADER2.51
LED4
  Top 0.254: J4.4 R8.2
  Bottom 0.254: INNER_HEADER2.52 81.28,85.72 82.55,84.45 82.55,79.76 79.76,76.96 79.76,46.74 58.42,25.4 58.42,24.13 58.17,23.88 J4.4
N$2
  Top 0.406: R9.1 42.15,71.09 D9.A
N$7
  Top 0.406: D1.A R1.1
N$20
  Top 0.406: D2.A R2.1
N$21
  Top 0.406: D3.A R3.1
N$22
  Top 0.406: D4.A R4.1
N$23
  Top 0.254: R5.1 D5.A
N$24
  Top 0.254: R6.1 D6.A
N$25
  Top 0.254: R7.1 D7.A
N$26
  Top 0.254: R8.1 D8.A
N$37
  Top 1.016: J2.P$3 163.32,7.49 L2.2 160.53,7.49 C2.1
N$38  (1 unrouted)
  Top 1.016: U$3.P$1 154.86,17.93 L2.1
RBF
  Top 0.406: U$16.P37 U$16.P38 59.69,92.08 63.63,96.01 86.36,96.01 88.9,93.47 88.9,85.72 82.55,79.38 31.75,79.38 27.3,74.93 EPS_RBF.5 EPS_RBF.3 EPS_RBF.1
USB_5V
  Top 0.406: USB.1 36.57,71.12 R9.2
  Bottom 0.813: INNER_HEADER2.P32 INNER_HEADER2.P31 52.07,80.77 50.8,79.5 42.42,79.5 38.86,75.95 38.86,72.64 37.37,71.15 USB.1

### Text on the board
tPlace: GND | BAT | 12 | 5 | 3.3 | GPS Antenna | +X | +Y | +Z | +X | +Y | +Z | Antennaboard / 05032017v3 | Dipole Antenna | Aleks Zozuls / Osi Van Dessel / Amber Willbanks / Zach Lasiuk / Maria Kromis / J. Brent Parham / David Einhorn / Brandon Ng / Phillip Teng / Hannah Levin / Allison Leung / Zachary Safran | Sun sensor | L2 | C2
bPlace: MAG
tNames: REMOVE BEFORE / FLIGHT!! | GND | 1234G | RFM22 / ANT
Measures: All units in inch | All units in inch